# Altium schematic sheet Full_Bridge_Push_Pull_Circuit.SchDoc
size A3; SheetNumber: 3; SheetTotal: 3
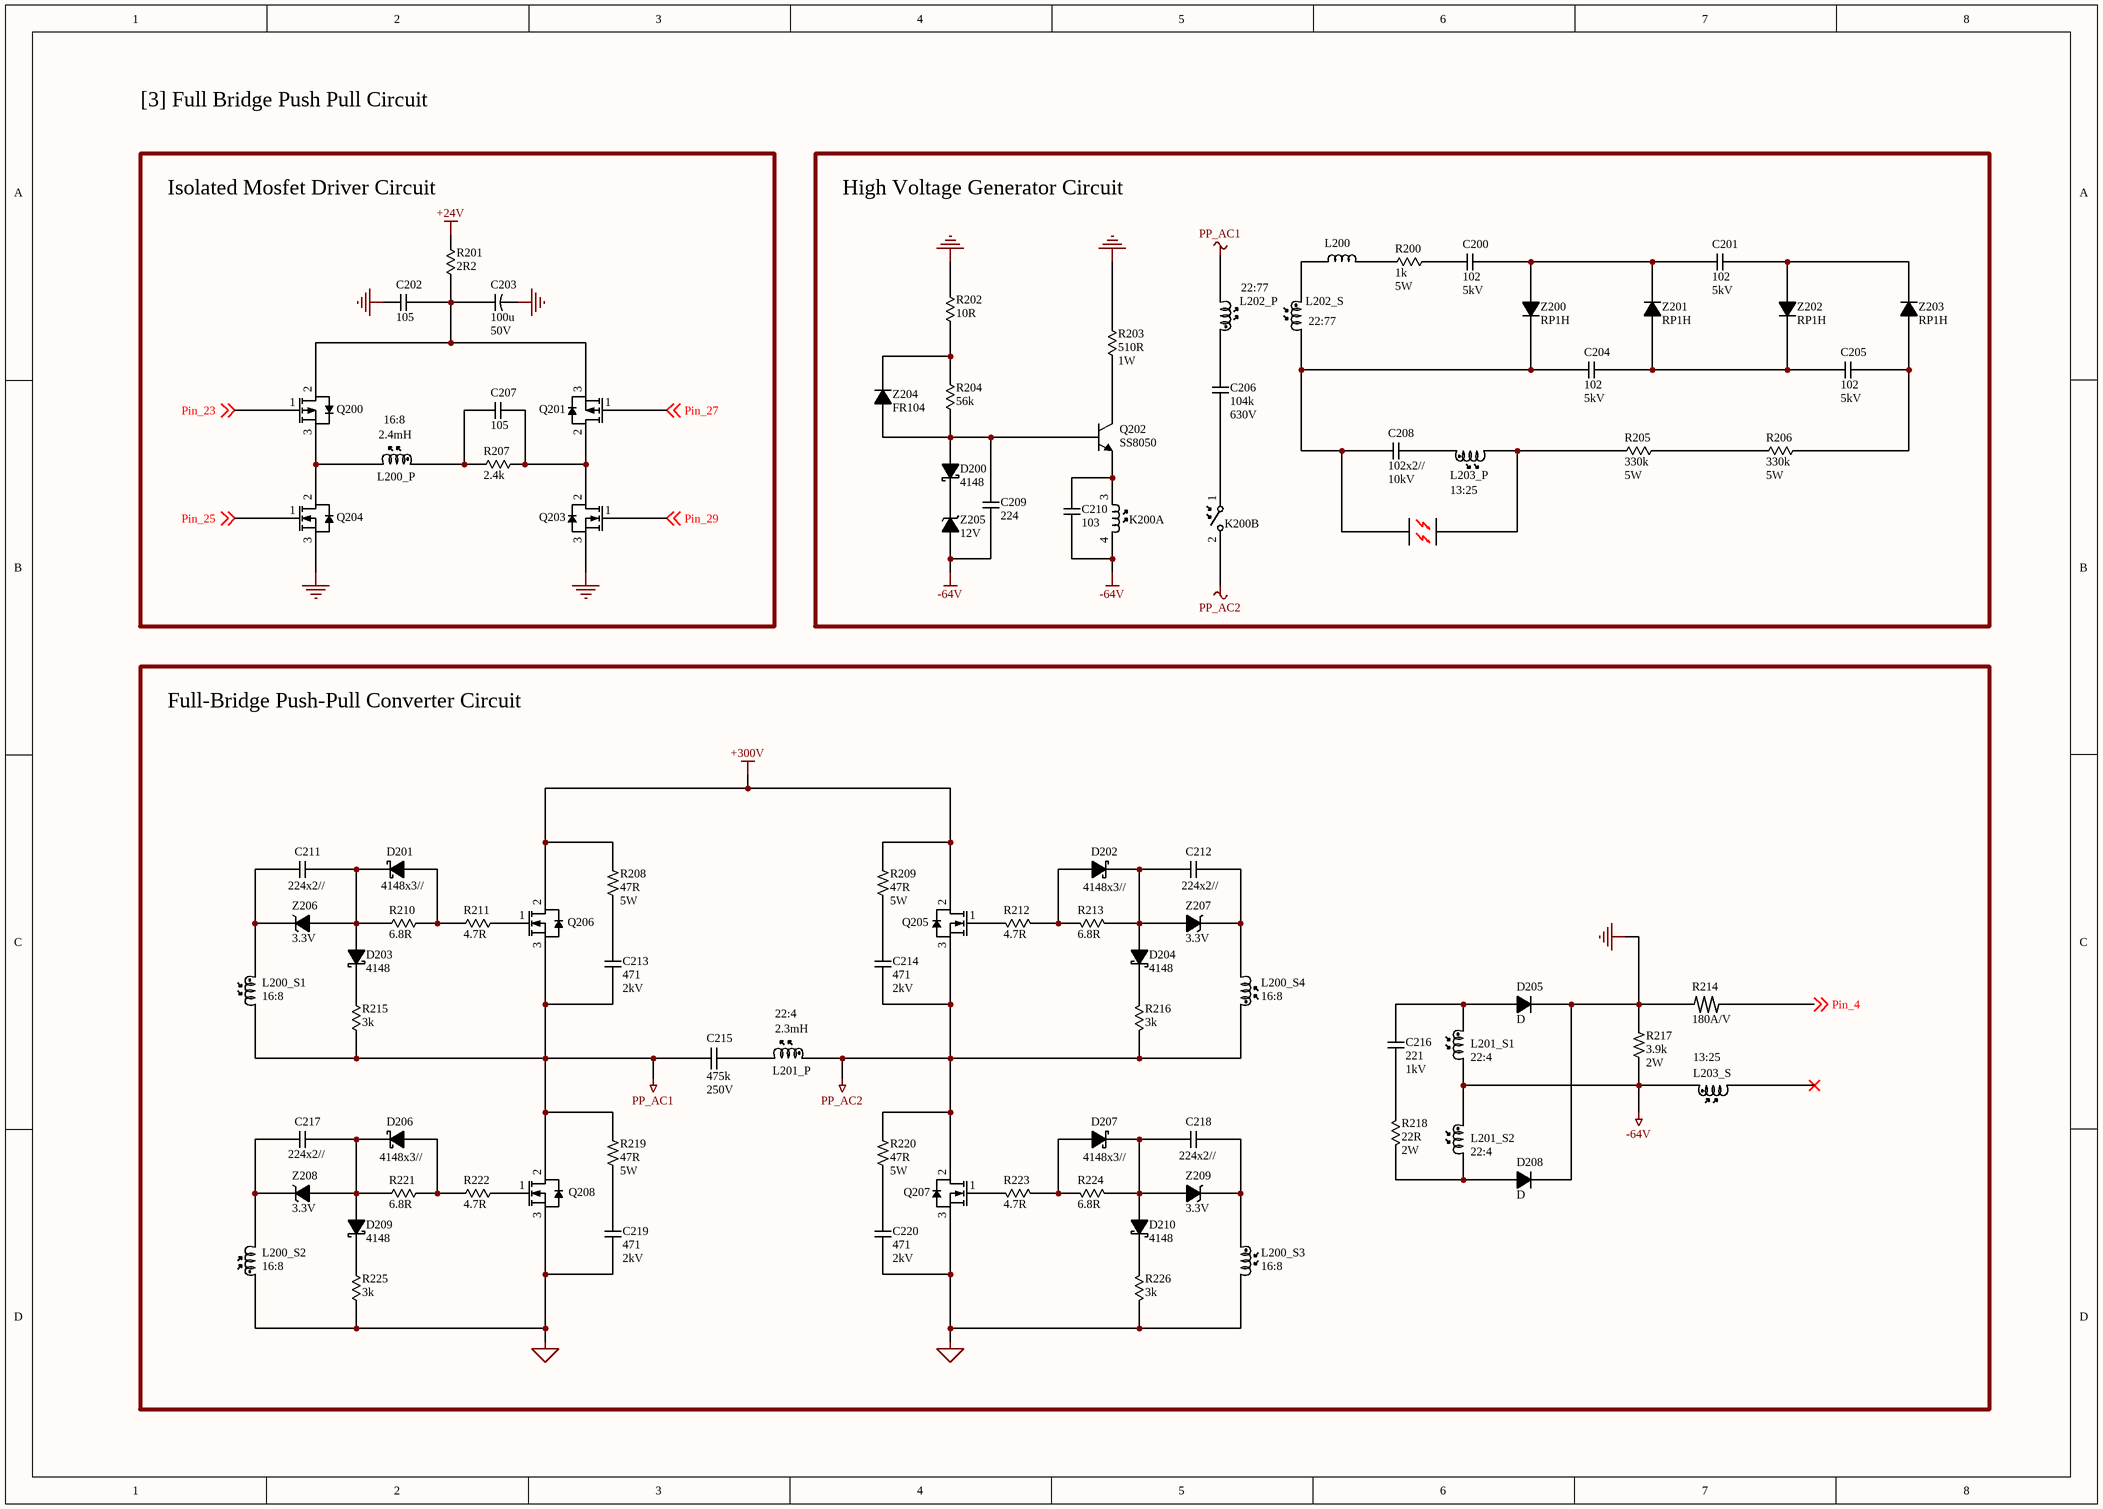
[diagram p0: Full_Bridge_Push_Pull_Circuit.SchDoc]

## Parts
C200  102  Voltage: 5kV  [Cap_THD_HVCeramic_5mm]
C201  102  Voltage: 5kV  [Cap_THD_HVCeramic_5mm]
C202  105  [Cap_THD_Ceramic_5mm]
C203  100u  Voltage: 50V  [Cap_THD_Polarized_5mm]
C204  102  Voltage: 5kV  [Cap_THD_HVCeramic_5mm]
C205  102  Voltage: 5kV  [Cap_THD_HVCeramic_5mm]
C206  104k  Voltage: 630V  [Cap_THD_Film_10mm]
C207  105  [Cap_THD_Ceramic_5mm]
C208  102x2//  Voltage: 10kV  [Cap_THD_HVCeramic_5mm]
C209  224  [Cap_THD_Ceramic_5mm]
C210  103  [Cap_THD_Ceramic_5mm]
C211  224x2//  [Cap_THD_Ceramic_5mm]
C212  224x2//  [Cap_THD_Ceramic_5mm]
C213  471  Voltage: 2kV  [Cap_THD_HVCeramic_5mm]
C214  471  Voltage: 2kV  [Cap_THD_HVCeramic_5mm]
C215  475k  Voltage: 250V  [Cap_THD_Film_22.5mm]
C216  221  Voltage: 1kV  [Cap_THD_Ceramic_5mm]
C217  224x2//  [Cap_THD_Ceramic_5mm]
C218  224x2//  [Cap_THD_Ceramic_5mm]
C219  471  Voltage: 2kV  [Cap_THD_HVCeramic_5mm]
C220  471  Voltage: 2kV  [Cap_THD_HVCeramic_5mm]
D200  4148  [Diode_THD_7.1mm]
D201  4148x3//  [Diode_THD_7.1mm]
D202  4148x3//  [Diode_THD_7.1mm]
D203  4148  [Diode_THD_7.1mm]
D204  4148  [Diode_THD_7.1mm]
D205  D  [Diode_THD_10.8mm]
D206  4148x3//  [Diode_THD_7.1mm]
D207  4148x3//  [Diode_THD_7.1mm]
D208  D  [Diode_THD_10.8mm]
D209  4148  [Diode_THD_7.1mm]
D210  4148  [Diode_THD_7.1mm]
K200  K  [Relay_10mm]  (value not drawn)  (parts A,B of 2)
K201  Spark_Gap  (value not drawn)
L200  L  [Inductor_THD_5mm]  (value not drawn)
L200_P  2.4mH  [Inductor_THD_5mm]
L200_S1  L  [Inductor_THD_5mm]  (value not drawn)
L200_S2  L  [Inductor_THD_5mm]  (value not drawn)
L200_S3  L  [Inductor_THD_5mm]  (value not drawn)
L200_S4  L  [Inductor_THD_5mm]  (value not drawn)
L201_P  2.3mH  [Inductor_THD_5mm]
L201_S1  L  [Inductor_THD_5mm]  (value not drawn)
L201_S2  L  [Inductor_THD_5mm]  (value not drawn)
L202_P  L  [Inductor_THD_5mm]  (value not drawn)
L202_S  L  [Inductor_THD_5mm]  (value not drawn)
L203_P  L  [Inductor_THD_5mm]  (value not drawn)
L203_S  L  [Inductor_THD_5mm]  (value not drawn)
Q200  IRF9Z24N  [TO220_3]  (value not drawn)
Q201  IRF9Z24N  [TO220_3]  (value not drawn)
Q202  SS8050  [TO92]
Q203  IRFZ24N  [TO220_3]  (value not drawn)
Q204  IRFZ24N  [TO220_3]  (value not drawn)
Q205  IRFP460  [TO247]  (value not drawn)
Q206  IRFP460  [TO247]  (value not drawn)
Q207  IRFP460  [TO247]  (value not drawn)
Q208  IRFP460  [TO247]  (value not drawn)
R200  1k  Power Rating: 5W  [Res_THD_0.25W_10mm]
R201  2R2  [Res_THD_0.25W_10mm]
R202  10R  [Res_THD_0.25W_10mm]
R203  510R  Power Rating: 1W  [Res_THD_0.25W_10mm]
R204  56k  [Res_THD_0.25W_10mm]
R205  330k  Power Rating: 5W  [Res_THD_0.25W_10mm]
R206  330k  Power Rating: 5W  [Res_THD_0.25W_10mm]
R207  2.4k  [Res_THD_0.25W_10mm]
R208  47R  Power Rating: 5W  [Res_THD_2W_17.6mm]
R209  47R  Power Rating: 5W  [Res_THD_2W_17.6mm]
R210  6.8R  [Res_THD_0.25W_10mm]
R211  4.7R  [Res_THD_0.25W_10mm]
R212  4.7R  [Res_THD_0.25W_10mm]
R213  6.8R  [Res_THD_0.25W_10mm]
R214  180A/V  [Res_THD_2W_17.6mm]
R215  3k  [Res_THD_0.25W_10mm]
R216  3k  [Res_THD_0.25W_10mm]
R217  3.9k  Power Rating: 2W  [Res_THD_2W_17.6mm]
R218  22R  Power Rating: 2W  [Res_THD_0.25W_10mm]
R219  47R  Power Rating: 5W  [Res_THD_2W_17.6mm]
R220  47R  Power Rating: 5W  [Res_THD_2W_17.6mm]
R221  6.8R  [Res_THD_0.25W_10mm]
R222  4.7R  [Res_THD_0.25W_10mm]
R223  4.7R  [Res_THD_0.25W_10mm]
R224  6.8R  [Res_THD_0.25W_10mm]
R225  3k  [Res_THD_0.25W_10mm]
R226  3k  [Res_THD_0.25W_10mm]
Z200  RP1H  [Diode_THD_10.8mm]
Z201  RP1H  [Diode_THD_10.8mm]
Z202  RP1H  [Diode_THD_10.8mm]
Z203  RP1H  [Diode_THD_10.8mm]
Z204  FR104  [Diode_THD_10.8mm]
Z205  12V  [Diode_THD_7.1mm]
Z206  3.3V  [Diode_THD_7.1mm]
Z207  3.3V  [Diode_THD_7.1mm]
Z208  3.3V  [Diode_THD_7.1mm]
Z209  3.3V  [Diode_THD_7.1mm]

## Blocks framed on the sheet
Isolated Mosfet Driver Circuit: C202 C203 C207 L200_P Q200 Q201 Q203 Q204 R201 R207
High Voltage Generator Circuit: C200 C201 C204-C206 C208-C210 D200 K200 K201 L200 L202_P L202_S L203_P Q202 R200 R202-R206 Z200-Z205
Full-Bridge Push-Pull Converter Circuit: C211-C220 D201-D210 L200_S1-L200_S4 L201_P L201_S1 L201_S2 L203_S Q205-Q208 R208-R226 Z206-Z209

## Nets
+24V: R201.4
+300V: Q205.2(Drain) Q206.2(Drain) R208.4 R209.4
-64V: C209.1 C210.1 K200.4(Coil_2) L201_S1.2 L201_S2.1 L203_S.1 R217.3 Z205.2(A)
GND: C202.1 C203.2(-) D205.1(K) D208.1(K) Q203.3(Source) Q204.3(Source) R202.4 R203.4 R214.3 R217.4
GND_1: C219.1 C220.1 L200_S2.1 L200_S3.2 Q207.3(Source) Q208.3(Source) R225.3 R226.3
PP_AC1: C213.1 C215.1 L200_S1.2 L202_P.1 Q206.3(Source) Q208.2(Drain) R215.3 R219.4
PP_AC2: C214.1 K200.2(SW_2) L200_S4.1 L201_P.2 Q205.3(Source) Q207.2(Drain) R216.3 R220.4
Pin_4: R214.4 ; off-sheet Pin_4
Pin_23: Q200.1(Gate) ; off-sheet Pin_23
Pin_25: Q204.1(Gate) ; off-sheet Pin_25
Pin_27: Q201.1(Gate) ; off-sheet Pin_27
Pin_29: Q203.1(Gate) ; off-sheet Pin_29
NetC200_1: C200.1 R200.3
NetC200_2: C200.2 C201.1 Z200.2(A) Z201.1(K)
NetC201_2: C201.2 Z202.2(A) Z203.1(K)
NetC202_2: C202.2 C203.1(+) Q200.2(Drain) Q201.3(Source) R201.3
NetC204_1: C204.1 C208.1 K201.1 L202_S.2 Z200.1(K)
NetC204_2: C204.2 C205.1 Z201.2(A) Z202.1(K)
NetC205_2: C205.2 R206.3 Z203.2(A)
NetC206_1: C206.1 K200.1(SW_1)
NetC206_2: C206.2 L202_P.2
NetC207_1: C207.1 L200_P.2 R207.3
NetC207_2: C207.2 Q201.2(Drain) Q203.2(Drain) R207.4
NetC208_2: C208.2 L203_P.2
NetC209_2: C209.2 D200.2(A) Q202.2(B) R204.3 Z204.2(A)
NetC210_2: C210.2 K200.3(Coil_1) Q202.1(E)
NetC211_1: C211.1 L200_S1.1 Z206.1(K)
NetC211_2: C211.2 D201.1(K) D203.2(A) R210.4 Z206.2(A)
NetC212_1: C212.1 L200_S4.2 Z207.1(K)
NetC212_2: C212.2 D202.1(K) D204.2(A) R213.4 Z207.2(A)
NetC213_2: C213.2 R208.3
NetC214_2: C214.2 R209.3
NetC215_2: C215.2 L201_P.1
NetC216_1: C216.1 D205.2(A) L201_S1.1
NetC216_2: C216.2 R218.4
NetC217_1: C217.1 L200_S2.2 Z208.1(K)
NetC217_2: C217.2 D206.1(K) D209.2(A) R221.4 Z208.2(A)
NetC218_1: C218.1 L200_S3.1 Z209.1(K)
NetC218_2: C218.2 D207.1(K) D210.2(A) R224.4 Z209.2(A)
NetC219_2: C219.2 R219.3
NetC220_2: C220.2 R220.3
NetD200_1: D200.1(K) Z205.1(K)
NetD201_2: D201.2(A) R210.3 R211.4
NetD202_2: D202.2(A) R212.4 R213.3
NetD203_1: D203.1(K) R215.4
NetD204_1: D204.1(K) R216.4
NetD206_2: D206.2(A) R221.3 R222.4
NetD207_2: D207.2(A) R223.4 R224.3
NetD208_2: D208.2(A) L201_S2.2 R218.3
NetD209_1: D209.1(K) R225.4
NetD210_1: D210.1(K) R226.4
NetK201_2: K201.2 L203_P.1 R205.4
NetL200_1: L200.1 L202_S.1
NetL200_2: L200.2 R200.4
NetL200_P_1: L200_P.1 Q200.3(Source) Q204.2(Drain)
NetQ202_3: Q202.3(C) R203.3
NetQ205_1: Q205.1(Gate) R212.3
NetQ206_1: Q206.1(Gate) R211.3
NetQ207_1: Q207.1(Gate) R223.3
NetQ208_1: Q208.1(Gate) R222.3
NetR202_3: R202.3 R204.4 Z204.1(K)
NetR205_3: R205.3 R206.4

Not connected (* = marked no-connect by the designer): L203_S 2*

## Notes on the sheet
- [3] Full Bridge Push Pull Circuit
- 22:77
- (near L202_S) 22:77
- (near L200_P) 16:8
- 13:25
- (near L200_S1) 16:8
- (near L201_P) 22:4
- (near L200_S4) 16:8
- (near L201_S1) 22:4
- (near L203_S) 13:25
- (near L201_S2) 22:4
- (near L200_S2) 16:8
- (near L200_S3) 16:8

## Library data of the parts
C200 C201 C204 C205 C208 C213 C214 C219 C220 = Cap_THD_HVCeramic_5mm: 5mm THD Ceramic High Voltage Capacitor
C202 C207 C209-C212 C217 C218 = Cap_THD_Ceramic_5mm: 5mm THD Ceramic Capacitor; Voltage: V
C203 = Cap_THD_Polarized_5mm: 5mm THD Polarized Capacitor
C206 = Cap_THD_Film_10mm
C215 = Cap_THD_Film_22.5mm
C216 = Cap_THD_Ceramic_5mm: 5mm THD Ceramic Capacitor
D200-D204 D206 D207 D209 D210 = 1N4148: Rectifier Diode Small Signal Switching 100V 0.2A 4ns Automotive 2-Pin DO-35 Ammo; Manufacturer: NXP Semiconductors; Forward Current: 200mA; Capacitance: 4pF; Polarity: Standard; Max Forward Surge Current (Ifsm): 4A; Element Configuration: Single; Supplier 1: Arrow Electronics; Manufacturer Part Number: 1N4148; RoHS: Yes; Category: Uncategorized; Case/Package: SOD; Number of Pins: 2; Max Operating Temperature: 200°C; Packaging: Ammo Pack; Reverse Recovery Time: 4ns; Max Repetitive Reverse Voltage (Vrrm): 100V; Current Rating: 200mA; Voltage Rating (DC): 100V; Output Current: 200mA; Current: 4A; Voltage: 100V; RoHS Compliant: Yes; Lead Free: Lead Free; Reach SVHC Compliant: No; ComponentLink1URL: https://datasheet.ciiva.com/1179/1720485-1179297.pdf?src-supplier=Element14; ComponentLink1Description: https://datasheet.ciiva.com/1179/1720485-1179297.pdf?src-supplier=Element14; ComponentLink2URL: https://datasheet.ciiva.com/26921/getdatasheetpartid-764103-26921186.pdf?src-supplier=Verical; ComponentLink2Description: https://datasheet.ciiva.com/26921/getdatasheetpartid-764103-26921186.pdf?src-supplier=Verical; Supplier Part Number 1: 1N4148
D205 D208 = Diode_THD_Rectifier: 10mm Axial Rectifier Diode
K200 = Relay
L200 = Inductor: Generic Inductor
L200_P L201_P L202_P L203_P = Inductor TX: TX Coupled Inductor
L200_S1-L200_S4 L201_S1 L201_S2 L202_S L203_S = Inductor RX: RX Coupled Inductor
Q200 Q201 = IRF9Z24N: Mosfet, Power; P-ch; Vdss -55V; Rds(on) 0.175 Ohm; Id -12A; TO-220AB; Pd 45W; Vgs +/-20V; Manufacturer: International Rectifier; Supplier 1: Allied Electronics; Manufacturer Part Number: IRF9Z24N; RoHS: No; Category: Uncategorized; Number of Pins: 3; RoHS Compliant: No; ComponentLink1URL: https://datasheet.ciiva.com/29326/162549-da-01-en-irf-9-z-24-n-29326126.pdf?src-supplier=Conrad; ComponentLink1Description: https://datasheet.ciiva.com/29326/162549-da-01-en-irf-9-z-24-n-29326126.pdf?src-supplier=Conrad; Supplier Part Number 1: 70017017
Q202 = SS8050: Bipolar Transistor BJT NPN Epitaxial Silicon 25V 1500mA 100MHz 1W TO-92-3; Manufacturer: ON Semiconductor / Fairchild; Manufacturer Part Number: SS8050DTA; Max Collector Current: 1.5A; Collector-emitter Voltage-Max: 500mV; hFE Min: 85; Collector Base Voltage (VCBO): 40V; Emitter Base Voltage (VEBO): 6V; Supplier 1: Future Electronics; RoHS: Yes; Category: BJTs; Stock 1: 10000; Pricing 1: 2000=0.0536, 6000=0.0516, 20000=0.0496, 40000=0.0484, 80000=0.0463 (USD); Mount: Through Hole; Case/Package: TO-92-3; Number of Pins: 3; Weight: 0.24g; Min Operating Temperature: -65°C; Max Operating Temperature: 150°C; Packaging: Ammo Pack; Series: -; Package Quantity: 2000; Max Power Dissipation: 1W; Transition Frequency: 100MHz; Collector Emitter Breakdown Voltage: 25V; Polarity: NPN; Collector Emitter Saturation Voltage: 500mV; Gain Bandwidth Product: 100MHz; Voltage Rating (DC): 25V; Collector Emitter Voltage (VCEO): 25V; Max Breakdown Voltage: 25V; Current Rating: 1.5A; Length: 4.58mm; Width: 3.86mm; Height: 4.58mm; Radiation Hardening: No; RoHS Compliant: Yes; Lead Free: Lead Free; Reach SVHC Compliant: No; ComponentLink1URL: https://datasheet.ciiva.com/4721/ss8050-117753-4721333.pdf?src-supplier=Mouser; ComponentLink1Description: https://datasheet.ciiva.com/4721/ss8050-117753-4721333.pdf?src-supplier=Mouser; ComponentLink2URL: https://datasheet.ciiva.com/11207/ss8050-11207512.pdf?src-supplier=Avnet; ComponentLink2Description: https://datasheet.ciiva.com/11207/ss8050-11207512.pdf?src-supplier=Avnet; ComponentLink3URL: https://datasheet.ciiva.com/18648/ss8050-18648133.pdf?src-supplier=Digi-Key; ComponentLink3Description: https://datasheet.ciiva.com/18648/ss8050-18648133.pdf?src-supplier=Digi-Key; ComponentLink4URL: https://datasheet.ciiva.com/17447/ss8050-17447834.pdf?src-supplier=Future+Electronics; ComponentLink4Description: https://datasheet.ciiva.com/17447/ss8050-17447834.pdf?src-supplier=Future+Electronics; ComponentLink5URL: https://datasheet.ciiva.com/46415/1868828-46415608.pdf?src-supplier=Element14; ComponentLink5Description: https://datasheet.ciiva.com/46415/1868828-46415608.pdf?src-supplier=Element14; Supplier Part Number 1: 7178421
Q203 Q204 = IRFZ24N: Mosfet, Power; N-ch; Vdss 55V; Rds(on) 0.07 Ohm; Id 17A; TO-220AB; Pd 45W; Vgs +/-20V; Manufacturer: International Rectifier; Gate to Source Voltage (Vgs): 20V; Number of Elements: 1; Supplier 1: Allied Electronics; Manufacturer Part Number: IRFZ24N; RoHS: No; Category: Uncategorized; Mount: Through Hole; Case/Package: TO-220AB; Number of Pins: 3; Min Operating Temperature: -55°C; Max Operating Temperature: 175°C; Continuous Drain Current (ID): 17A; Power Dissipation: 45W; RoHS Compliant: No; Supplier Part Number 1: 70017049
Q205-Q208 = IRFP460: MOSFET N-CH 500V 20A TO-247AC; Manufacturer: Vishay; Manufacturer Part Number: IRFP460LCPBF; Rise Time: 77ns; Drain to Source Resistance: 270mR; Gate to Source Voltage (Vgs): 30V; Input Capacitance: 3.6nF; Max Power Dissipation: 280W; Fall Time: 43ns; Polarity: N-CHANNEL; Turn-Off Delay Time: 40ns; Turn-On Delay Time: 18ns; Number of Channels: 1; Threshold Voltage: 4V; Polarization: N; Supplier 1: Mouser; RoHS: Yes; Category: MOSFETs; Stock 1: 2457; Pricing 1: 1=4.66, 10=4.66, 50=4.66, 100=3.82, 1000=2.37, 10000=2.28 (USD); Mount: Through Hole; Case/Package: TO-247-3; Number of Pins: 3; Weight: 1.340411oz; Min Operating Temperature: -55°C; Max Operating Temperature: 150°C; Packaging: Rail/Tube; Continuous Drain Current (ID): 20A; Package Quantity: 500; Rds On Max: 270mR; Drain to Source Voltage (Vdss): 500V; Voltage Rating (DC): 500V; Current Rating: 20A; Drain to Source Breakdown Voltage: 500V; Power Dissipation: 280W; Nominal Vgs: 4V; Drain-source On Resistance-Max: 270mR; Current: 20A; Voltage: 500V; Length: 15.87mm; Width: 5.31mm; Height: 20.7mm; Lead Free: Lead Free; RoHS Compliant: Yes; Reach SVHC Compliant: Unknown; ComponentLink1URL: https://datasheet.ciiva.com/4439/91235-86256-4439273.pdf?src-supplier=Mouser; ComponentLink1Description: https://datasheet.ciiva.com/4439/91235-86256-4439273.pdf?src-supplier=Mouser; ComponentLink2URL: https://datasheet.ciiva.com/22754/1349722-22754579.pdf?src-supplier=Farnell; ComponentLink2Description: https://datasheet.ciiva.com/22754/1349722-22754579.pdf?src-supplier=Farnell; ComponentLink3URL: https://datasheet.ciiva.com/8025/irfp460lc-8025611.pdf?src-supplier=Element14; ComponentLink3Description: https://datasheet.ciiva.com/8025/irfp460lc-8025611.pdf?src-supplier=Element14; ComponentLink4URL: https://datasheet.ciiva.com/6385/91235-6385806.pdf?src-supplier=Digi-Key; ComponentLink4Description: https://datasheet.ciiva.com/6385/91235-6385806.pdf?src-supplier=Digi-Key; ComponentLink5URL: https://datasheet.ciiva.com/16358/91235-16358139.pdf?src-supplier=Future+Electronics; ComponentLink5Description: https://datasheet.ciiva.com/16358/91235-16358139.pdf?src-supplier=Future+Electronics; ComponentLink6URL: https://datasheet.ciiva.com/7643/1349722-7643339.pdf?src-supplier=Element14; ComponentLink6Description: https://datasheet.ciiva.com/7643/1349722-7643339.pdf?src-supplier=Element14; ComponentLink7URL: https://datasheet.ciiva.com/18432/70078943-18432519.pdf?src-supplier=Allied+Electronics; ComponentLink7Description: https://datasheet.ciiva.com/18432/70078943-18432519.pdf?src-supplier=Allied+Electronics; Supplier Part Number 1: 844-IRFP460LCPBF
R200 R203 R205 R206 R218 = Res_THD_0.25W: 250mW THD Resistor
R201 R202 R204 R207 R210-R213 R215 R216 R221-R226 = Res_THD_0.25W: 250mW THD Resistor; Power Rating: 0.25W
R208 R209 R217 R219 R220 = Res_THD_2W: 500mW THD Resistor
R214 = Res_THD_Shunt: 500mW THD Resistor; Power Rating: 2W
Z200-Z204 = Diode_THD_FRD: 10mm Axial Fast Recovery Diode
Z205-Z209 = Diode_THD_Zener: 10mm Axial Zener Diode